# EasyEDA Pro project MPU6500模块.eprj

# Schematic Schematic1
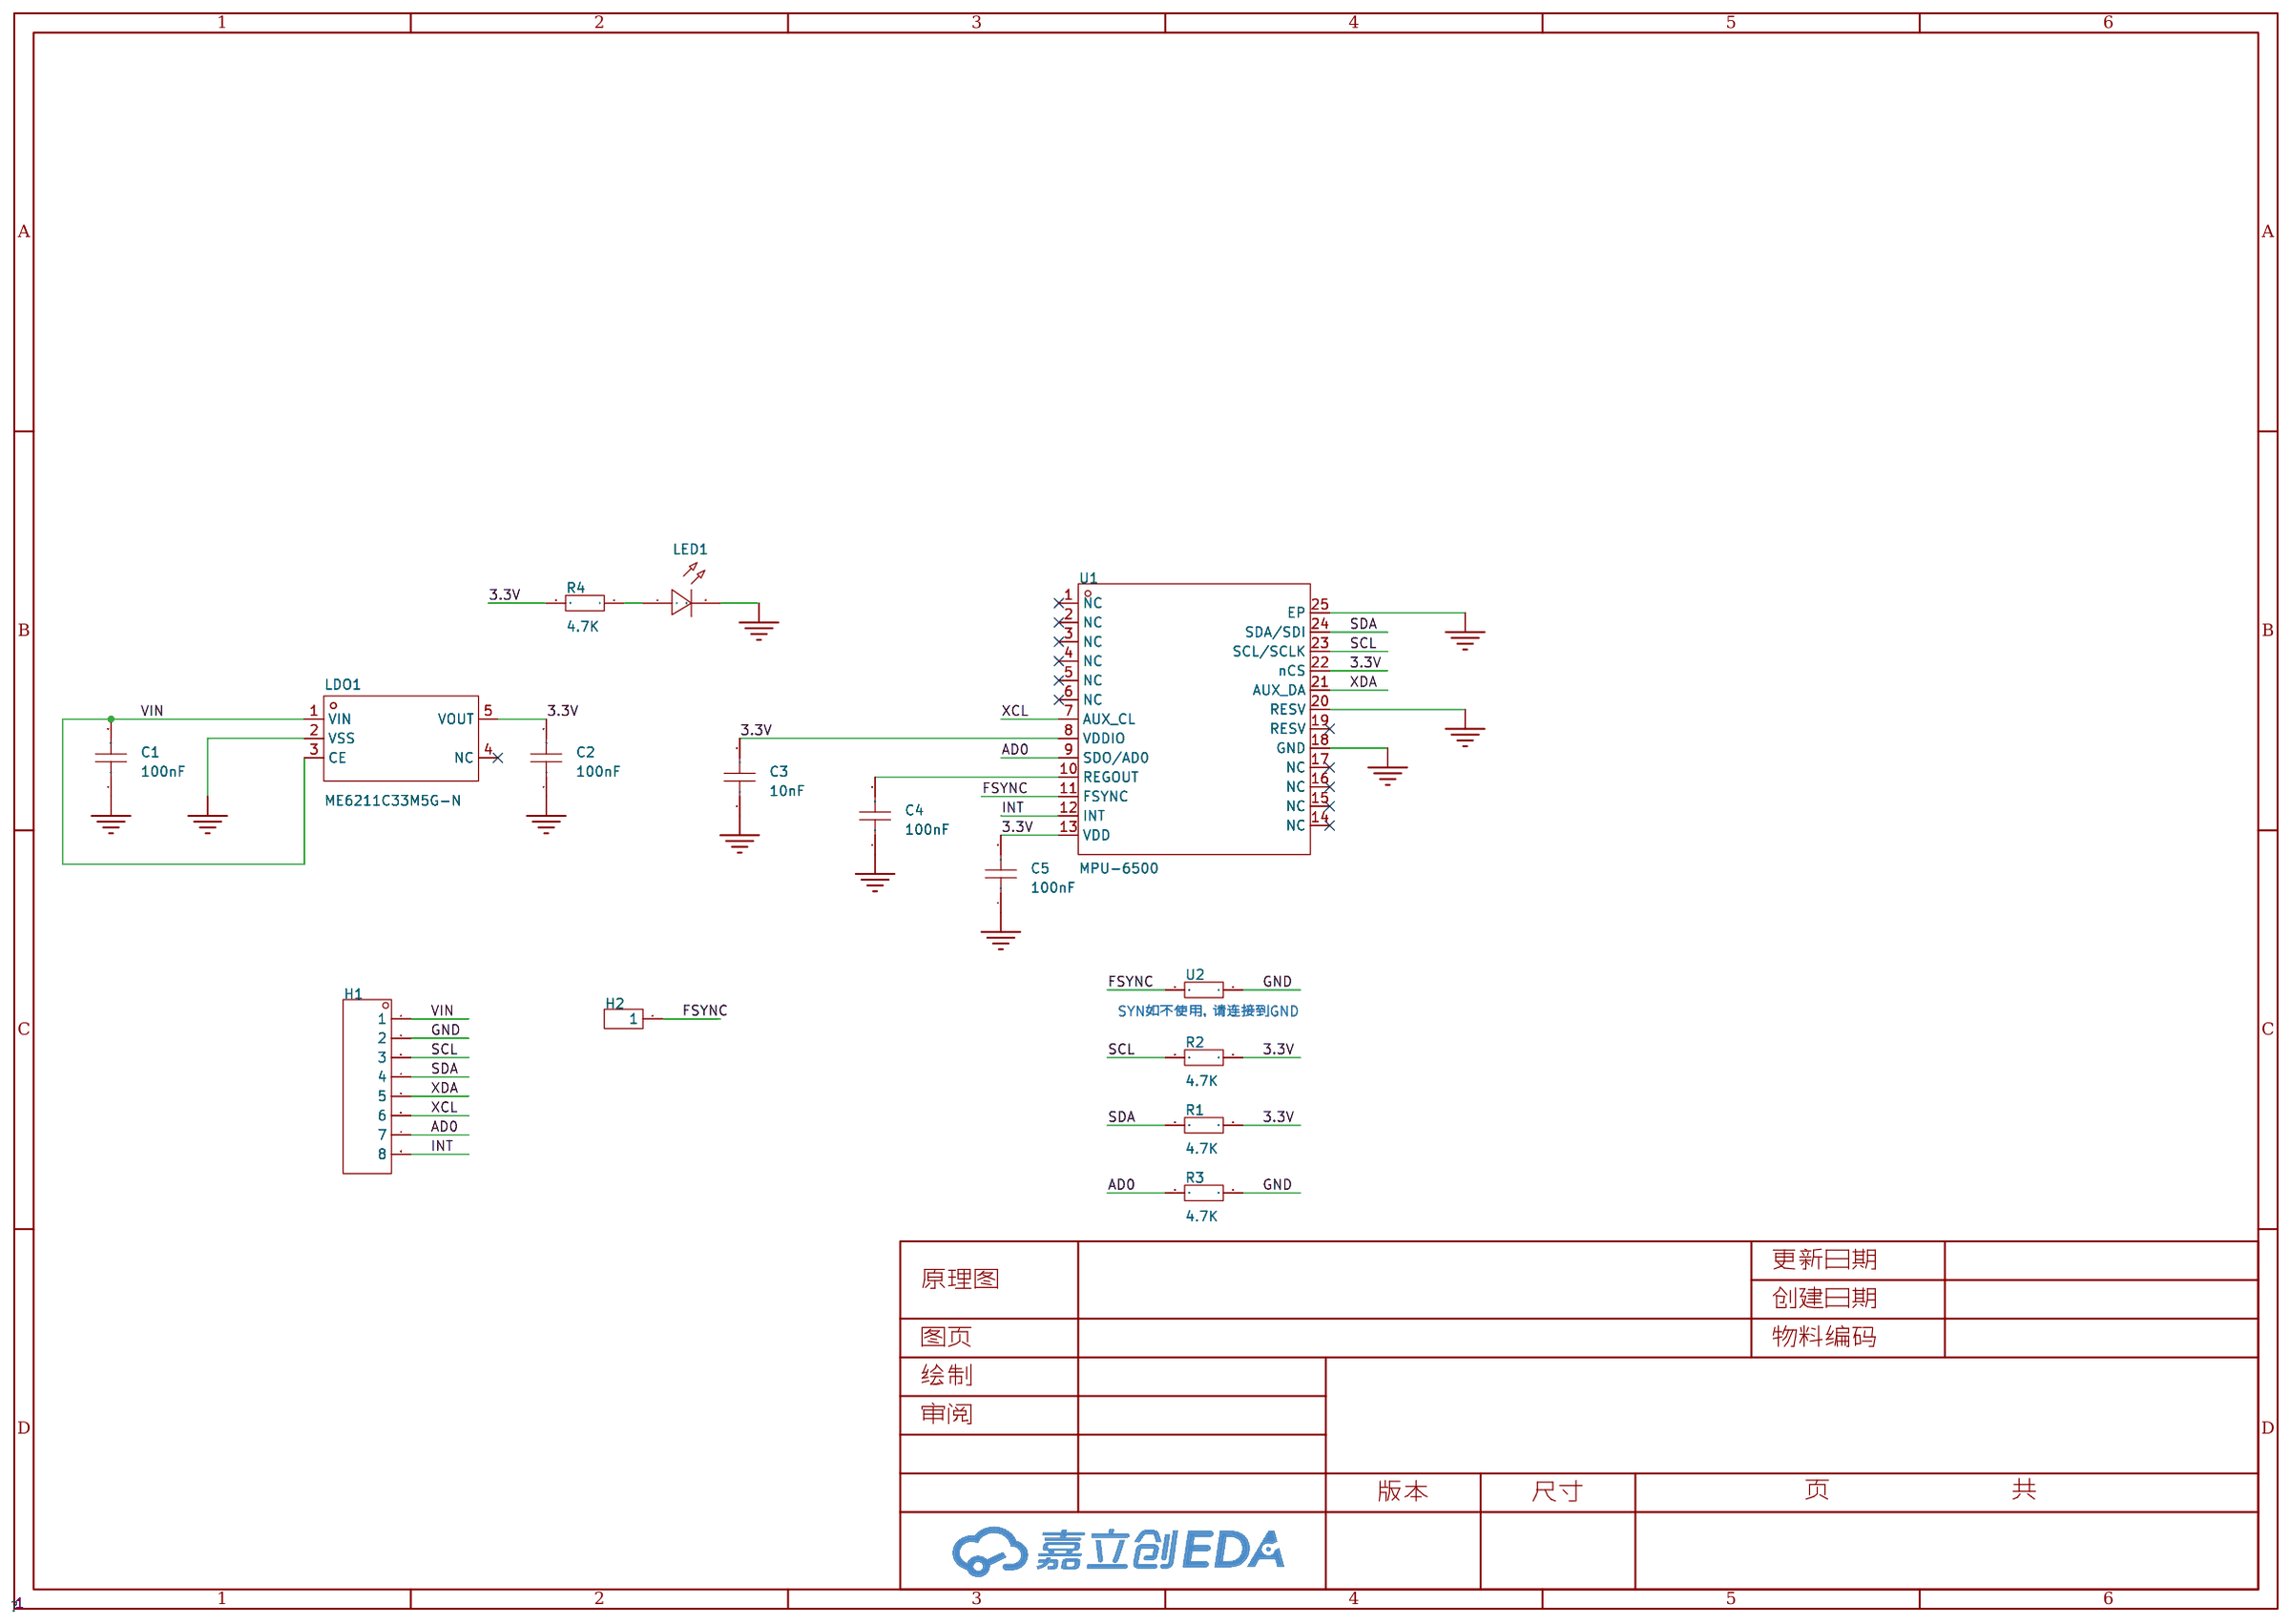
[diagram p0: schematic sheet]

## Parts
C1  100nF  [CAP_0603]
C2  100nF  [CAP_0603]
C3  10nF  [CAP_0603]
C4  100nF  [CAP_0603]
C5  100nF  [CAP_0603]
H1  -  [mpu6500模块引脚]
H2  -  [1pin]
LDO1  ME6211C33M5G-N  [SOT-23-5_L3.0-W1.7-P0.95-LS2.8-BL]
LED1  -  [LED_0603_RED]
R1  4.7K  [RES_0603]
R2  4.7K  [RES_0603]
R3  4.7K  [RES_0603]
R4  4.7K  [RES_0603]
U1  MPU-6500  [QFN-24_L3.0-W3.0-P0.40-BL-EP]
U2  -  [R0603]

## Library data of the parts
C1-C5 = CAP_0603: Supplier Footprint: 0603
H1 = HDR-M_2.54_1x8P: Supplier Part: C124381; Supplier Footprint: 插件
H2 = HDR-M_2.54_1x1P: Supplier Part: C81276; Supplier Footprint: 插件; JLCPCB Part Class: Extended Part
LDO1 = ME6211C33M5G-N: 输出类型:固定;最大输入电压:6V;输出电压:3.3V;最大输出电流:500mA;电源纹波抑制比(PSRR):70dB;输出极性:正极;; LCSC Part Name: 输入6V 输出3.3V 500mA; Supplier Part: C82942; Manufacturer: MICRONE(南京微盟); Supplier Footprint: SOT-23-5; JLCPCB Part Class: 扩展库; Datasheet: https://atta.szlcsc.com/upload/public/pdf/source/20170918/C82942_1505727073070976520.pdf; Supplier: LCSC; Output Type: 固定; Maximum Input Voltage: 6V; Output Voltage: 3.3V; MAX Output Current: 500mA; Power Supply Rejection Ratio (PSRR): 70dB; Dropout Voltage: 260mV@(200mA); Output Polarity: 正极; Number of Outputs: 1
LED1 = LED0603_R
R1-R4 = Res_0603: Supplier Footprint: 0603
U1 = MPU-6500_C50278: 传感器类型:加速度计陀螺仪;; Supplier Part: C50278; Manufacturer: TDK InvenSense(应美盛); Supplier Footprint: QFN-24-EP(3x3); JLCPCB Part Class: 扩展库; Datasheet: https://atta.szlcsc.com/upload/public/pdf/source/20170505/1493957890595.pdf; Supplier: LCSC; Sensor Type: 加速度计陀螺仪; Operating Temperature: -40℃~+85℃
U2 = jump-0603: 0603封装的跳线; LCSC Part Name: 220Ω(2200) ±1% 编带; Supplier Part: C22962; Manufacturer: UNI-ROYAL(厚声); Manufacturer Part: 0603WAF2200T5E; Supplier Footprint: 0603; Datasheet: https://atta.szlcsc.com/upload/public/pdf/source/20170920/C22962_1505901005703982349.pdf; Supplier: LCSC

## Nets
3.3V: C2.2 C3.2 C5.2 LDO1.5(VOUT) R1.1 R2.1 R4.2 U1.8(VDDIO) U1.13(VDD) U1.22(nCS)
GND: C1.1 C2.1 C3.1 C4.1 C5.1 H1.2 LDO1.2(VSS) LED1.2(C) R3.1 U1.18(GND) U1.20(RESV) U1.25(EP) U2.1
VIN: C1.2 H1.1 LDO1.1(VIN) LDO1.3(CE)
AD0: H1.7 R3.2 U1.9(SDO/AD0)
FSYNC: H2.1 U1.11(FSYNC) U2.2
INT: H1.8 U1.12(INT)
SCL: H1.3 R2.2 U1.23(SCL/SCLK)
SDA: H1.4 R1.2 U1.24(SDA/SDI)
XCL: H1.6 U1.7(AUX_CL)
XDA: H1.5 U1.21(AUX_DA)
$1N590: C4.2 U1.10(REGOUT)
$1N1524: LED1.1(A) R4.1

Not connected (* = marked no-connect by the designer): LDO1 4(NC)*; U1 1(NC)* 2(NC)* 3(NC)* 4(NC)* 5(NC)* 6(NC)* 14(NC)* 15(NC)* 16(NC)* 17(NC)* 19(RESV)*

## Notes on the sheet
- SYN如不使用，请连接到GND

# Board PCB103
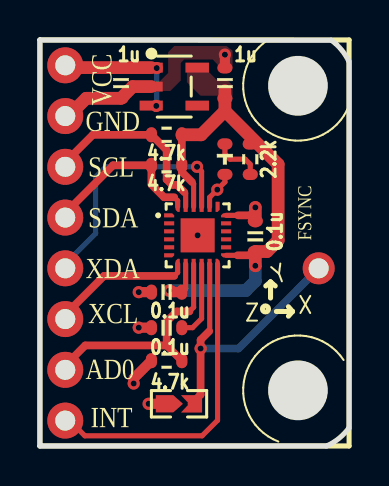
[diagram p1: board, top side]
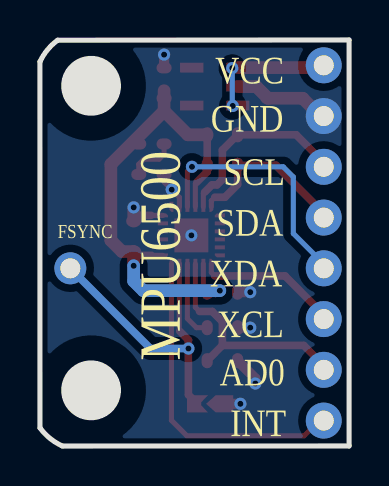
[diagram p2: board, bottom side, seen from below]

Outline 15.49 x 20.32 mm; copper layers: Top Layer, Bottom Layer. Coordinates in mm from the lower left corner of the outline.
Outline path: 0,20.32 0,0 14.36,0 arc(14.99,0.38) 15.49,0.91 15.49,19.23 arc(15.12,19.82) 14.61,20.31 0,20.32
Stack: Top Layer 0.035mm / Dielectric1 1.51mm FR4 er 4.5 / Bottom Layer 0.035mm

## Design rules (mm)
template: 自定义配置
spacing copperThickness1oz (default): track to track 0.102, other pairs 0.152 to 0.3
spacing copperThickness2oz: track to track 0.203, other pairs 0.152 to 0.3
track width copperThickness1oz (default): min 0.127, default 0.254, max 2.54
track width copperThickness2oz: min 0.203, default 0.254, max 2.54
differential pair differentialPair (default): width min 0.127, default 0.254, max 2.54; gap min 0.152, default 0.152
via viaSize (default): diameter min 0.5, default 0.61, max 10; hole min 0.3, default 0.305, max 6.3

## Placement (name value [footprint] x y rotation side)
C1  100nF  [CAP_0603]  4.06 18.16 90 top
C2  100nF  [CAP_0603]  9.27 18.16 270 top
C3  10nF  [CAP_0603]  6.35 7.7 0 top
C4  100nF  [CAP_0603]  6.35 5.92 0 top
C5  100nF  [CAP_0603]  10.8 10.5 270 top
H1  -  [mpu6500模块引脚]  1.27 19.05 0 top
H2  -  [1pin]  13.97 8.89 0 top
LDO1  ME6211C33M5G-N  [SOT-23-5_L3.0-W1.7-P0.95-LS2.8-BL]  6.73 17.99 270 top
LED1  -  [LED_0603_RED]  9.27 14.35 270 top
R1  4.7K  [RES_0603]  6.35 14.05 180 top
R2  4.7K  [RES_0603]  6.35 15.58 180 top
R3  4.7K  [RES_0603]  6.35 4.27 0 top
R4  4.7K  [RES_0603]  10.54 14.35 90 top
U1  MPU-6500  [QFN-24_L3.0-W3.0-P0.40-BL-EP]  7.9 10.54 270 top
U2  -  [R0603]  6.97 2.11 0 top

## Footprints (pads in the part's own frame, mm; a bottom-side part is the same pattern mirrored in y, then rotated)
1pin
  round 1.6 hole 1: 1(0,0)
CAP_0603
  rrect 0.559x0.762 smd: 1(-0.762,0) 2(0.762,0)
LED_0603_RED
  rrect 0.559x0.762 smd: 1(-0.762,0) 2(0.762,0)
mpu6500模块引脚
  round 1.8 hole 1: 1(0,0) 2(0,-2.54) 3(0,-5.08) 4(0,-7.62) 5(0,-10.16) 6(0,-12.7) 7(0,-15.24) 8(0,-17.78)
QFN-24_L3.0-W3.0-P0.40-BL-EP
  custom 0.2x0.506 smd: 1(-1,-1.427) 6(1,-1.427) 13(1,1.427) 18(-1,1.427)
  rect 0.2x0.505 smd: 2(-0.6,-1.427) 3(-0.2,-1.427) 4(0.2,-1.427) 5(0.6,-1.427) 14(0.6,1.427) 15(0.2,1.427) 16(-0.2,1.427) 17(-0.6,1.427)
  custom 0.506x0.2 smd: 7(1.427,-1) 12(1.427,1) 19(-1.427,1) 24(-1.427,-1)
  rect 0.505x0.2 smd: 8(1.427,-0.6) 9(1.427,-0.2) 10(1.427,0.2) 11(1.427,0.6) 20(-1.427,0.6) 21(-1.427,0.2) 22(-1.427,-0.2) 23(-1.427,-0.6)
  rect 1.7x1.7 smd: 25(0,0)
R0603
  custom 1.357x0.864 smd: 1(-0.485,0.003)
  custom 1.056x0.864 smd: 2(0.625,0)
RES_0603
  rrect 0.559x0.762 smd: 1(-0.762,0) 2(0.762,0)
SOT-23-5_L3.0-W1.7-P0.95-LS2.8-BL
  rect 0.49x1.157 smd: 1(-0.95,-1.153) 2(0,-1.153) 3(0.95,-1.153)
  rect 0.49x1.175 smd: 4(0.95,1.153) 5(-0.95,1.153)

## Nets
As in the schematic.

Pads without a net: LDO1 4; U1 1 2 3 4 5 6 14 15 16 17 19

## Via types
v1: diameter 0.61, hole 0.305, Top Layer to Bottom Layer, 14 vias

## Routing (per net, layer and track width the routed paths; a pad name or vN(x,y) marks a point on that pad's centre or on a via; arc(x,y) is an arc through that point)
3.3V: length 26.2
  Top Layer w0.254: U1.13 9.91,9.54 ; C3.2 7.3,7.89 7.3,9.12 ; 7.62,13.21 7.7,13.13 U1.22
  Top Layer w0.381: C5.2 10.61,9.54 9.91,9.54 ; R2.1 R1.1 7.11,13.72 7.62,13.21
  Top Layer w0.508: C3.2 6.68,7.7 6.61,7.78 v1(6.48,7.78)
  Top Layer w0.635: 9.27,16.77 C2.2 9.27,17.78 ; 9.27,16.77 8.08,15.58 R2.1 ; 9.27,16.77 11.94,14.1 11.94,10.29 11.38,9.73 C5.2 v1(10.8,9.02)
  Bottom Layer w0.635: v1(6.48,7.78) 10.31,7.78 10.8,8.26 v1(10.8,9.02)
GND: length 13.7
  Top Layer w0.254: U1.20 8.5,12.44 v1(8.89,12.83) 9.27,13.21 LED1.2 ; U1.18 9.92,11.54
  Top Layer w0.381: 9.92,11.54 10.51,11.54 C5.1
  Top Layer w0.508: v1(4.7,3.13) 4.7,3.38 R3.1 ; v1(4.95,5.92) C4.1 ; U2.1 6.48,2.11 v1(5.45,2.11) ; v1(4.95,7.7) C3.1 ; C2.1 v1(9.27,19.59)
  Top Layer w0.635: LDO1.2 4.65,17.99 C1.1 2.32,17.4 1.27,16.35 ; C5.1 v1(10.8,11.94)
  vias: v1(7.9,10.54)
VIN: length 6.2
  Top Layer w0.635: LDO1.1 1.32,18.94 1.27,18.89
  Bottom Layer w0.254: v1(5.85,18.92) 5.85,17.04 v1(5.83,17.02)
AD0: length 11.6
  Top Layer w0.254: 7.7,9.12 7.7,6.95 7.49,6.73
  Top Layer w0.381: 6.35,5.03 6.35,6.23 6.86,6.73 7.49,6.73 ; 6.35,5.03 R3.2 ; 6.35,5.03 2.27,5.03 1.27,4.03
FSYNC: length 15
  Top Layer w0.254: 8.48,5.74 8.51,5.77 8.51,9.11 8.5,9.12
  Top Layer w0.381: 8.48,5.74 8.05,5.31 v1(8.05,4.88) 8.05,2.57 U2.2
  Bottom Layer w0.381: H2.1 9.96,4.88 v1(8.05,4.88)
INT: length 16.2
  Top Layer w0.254: 1.27,1.49 2.25,0.51 8.13,0.51 8.9,1.29 8.9,9.12
SCL: length 9.4
  Top Layer w0.254: 7.24,12.7 7.3,12.64 U1.23
  Top Layer w0.381: 7.24,12.7 6.87,13.07 6.62,13.07 6.35,13.34 6.35,14.81 R2.2 2.65,15.58 1.27,14.19
SDA: length 8.2
  Top Layer w0.254: U1.24 6.9,12.28 6.73,12.45
  Top Layer w0.381: 6.73,12.45 6.22,12.45 5.59,13.08 R1.2 3.67,14.05 1.27,11.65
XCL: length 6.9
  Top Layer w0.254: 6.9,9.12 6.9,8.69 6.73,8.51
  Top Layer w0.381: 6.73,8.51 3.21,8.51 1.27,6.57
XDA: length 12.4
  Top Layer w0.254: U1.21 8.1,13.74 v1(7.87,13.97)
  Bottom Layer w0.254: 1.27,9.11 2.79,10.64 2.79,13.47 3.3,13.97 v1(7.87,13.97)
$1N590: length 3.9
  Top Layer w0.254: C4.2 7.65,5.92 8.1,6.38 8.1,9.12
$1N1524: length 2.5
  Top Layer w0.254: LED1.1 9.27,14.61 9.53,14.35 10.29,14.35 10.54,14.1 R4.1

## Copper pours and planes (outline as drawn; the poured copper is in the pictures)
3.3V on Top Layer: 7.37,18.93 9.65,18.93 9.65,17.53 7.37,17.53
GND on Top Layer: 5.98,20.02 9.65,20.02 9.65,17.77 5.98,17.77
GND on Bottom Layer: 0,20.54 15.49,20.54 15.49,0.22 0,0.22

## Text on the board
Bottom Silkscreen Layer: FSYNC | INT | SCL | AD0 | XCL | SDA | VCC | GND | XDA | MPU6500
Top Silkscreen Layer: 1u | 0.1u | 4.7k | 2.2k | Z | X | Y | → | FSYNC | XDA | AD0 | SCL | SDA | XCL | VCC | GND | INT
